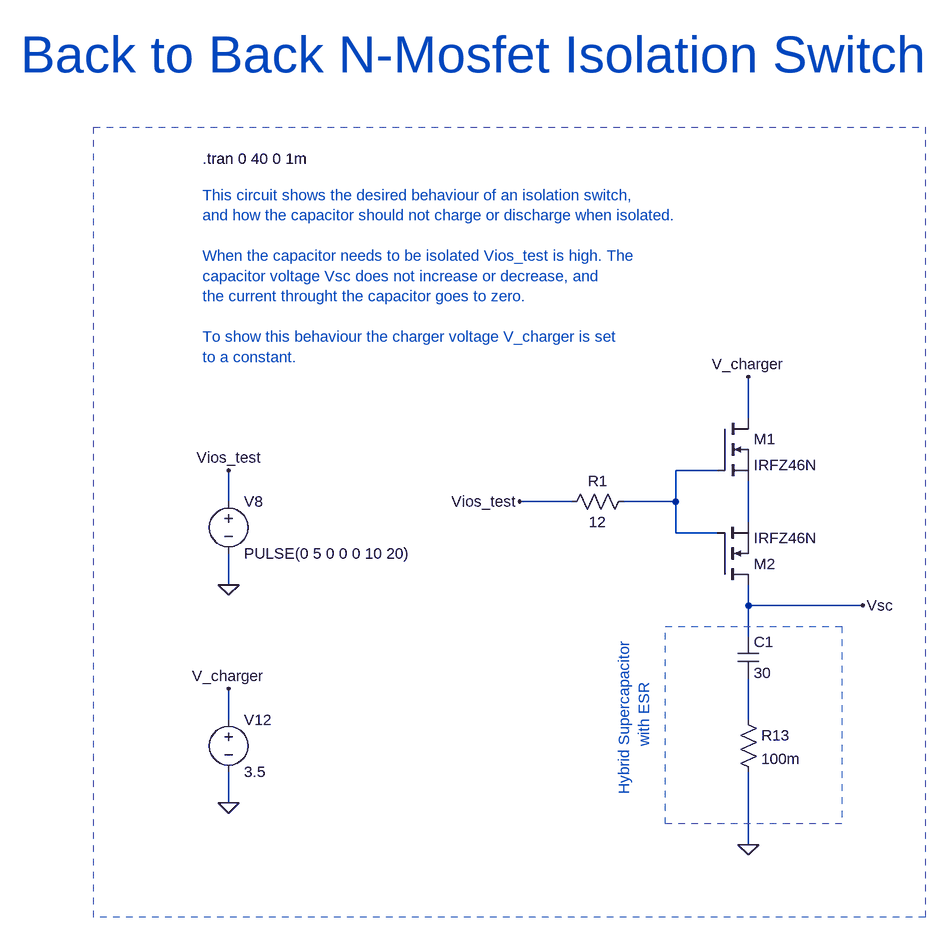
[diagram p0: schematic isolation_switch.asc]
isolation_switch.asc, the LTspice schematic file:
Version 4.1
SHEET 1 4908 2508
WIRE 4288 -160 4288 -224
WIRE 4240 -80 4176 -80
WIRE 3488 -32 3488 -80
WIRE 4016 -32 3936 -32
WIRE 4176 -32 4176 -80
WIRE 4176 -32 4096 -32
WIRE 4288 0 4288 -64
WIRE 4176 16 4176 -32
WIRE 4240 16 4176 16
WIRE 3488 96 3488 48
WIRE 4288 128 4288 96
WIRE 4464 128 4288 128
WIRE 4288 176 4288 128
WIRE 3488 304 3488 256
WIRE 4288 304 4288 240
WIRE 3488 432 3488 384
WIRE 4288 496 4288 384
FLAG 4288 496 0
FLAG 3488 96 0
FLAG 3488 -80 Vios_test
FLAG 3936 -32 Vios_test
FLAG 3488 432 0
FLAG 3488 256 V_charger
FLAG 4288 -224 V_charger
FLAG 4464 128 Vsc
SYMBOL nmos 4240 -160 R0
SYMATTR InstName M1
SYMATTR Value IRFZ46N
SYMBOL nmos 4240 96 M180
SYMATTR InstName M2
SYMATTR Value IRFZ46N
SYMBOL cap 4272 176 R0
SYMATTR InstName C1
SYMATTR Value 30
SYMBOL res 4272 288 R0
SYMATTR InstName R13
SYMATTR Value 100m
SYMBOL voltage 3488 -48 R0
WINDOW 123 0 0 Left 0
WINDOW 39 0 0 Left 0
SYMATTR InstName V8
SYMATTR Value PULSE(0 5 0 0 0 10 20)
SYMBOL voltage 3488 288 R0
WINDOW 123 0 0 Left 0
WINDOW 39 0 0 Left 0
SYMATTR InstName V12
SYMATTR Value 3.5
SYMBOL res 4112 -48 R90
WINDOW 0 0 56 VBottom 2
WINDOW 3 32 56 VTop 2
SYMATTR InstName R1
SYMATTR Value 12
TEXT 3448 -504 Left 2 ;This circuit shows the desired behaviour of an isolation switch,\nand how the capacitor should not charge or discharge when isolated.\n \nWhen the capacitor needs to be isolated Vios_test is high. The \ncapacitor voltage Vsc does not increase or decrease, and\nthe current throught the capacitor goes to zero.\n \nTo show this behaviour the charger voltage V_charger is set\nto a constant.
TEXT 3168 -720 Left 6 ;Back to Back N-Mosfet Isolation Switch
TEXT 4112 296 VCenter 2 ;Hybrid Supercapacitor \nwith ESR
TEXT 3448 -560 Left 2 !.tran 0 40 0 1m
RECTANGLE Normal 4560 608 3280 -608 2
RECTANGLE Normal 4432 464 4160 160 2

The netlist it stands for:
* isolation_switch.asc
M1 V_charger N001 N002 N002 IRFZ46N
M2 Vsc N001 N002 N002 IRFZ46N
C1 Vsc N003 30
R13 N003 0 100m
V8 Vios_test 0 PULSE(0 5 0 0 0 10 20)
V12 V_charger 0 3.5
R1 N001 Vios_test 12
.model NMOS NMOS
.model PMOS PMOS
.lib standard.mos
* This circuit shows the desired behaviour of an isolation switch,
* and how the capacitor should not charge or discharge when isolated.
* When the capacitor needs to be isolated Vios_test is high. The
* capacitor voltage Vsc does not increase or decrease, and
* the current throught the capacitor goes to zero.
* To show this behaviour the charger voltage V_charger is set
* to a constant.
* Back to Back N-Mosfet Isolation Switch
* Hybrid Supercapacitor
* with ESR
.tran 0 40 0 1m
.backanno
.end

* Results of the author's LTspice run, read from the files saved beside the schematic
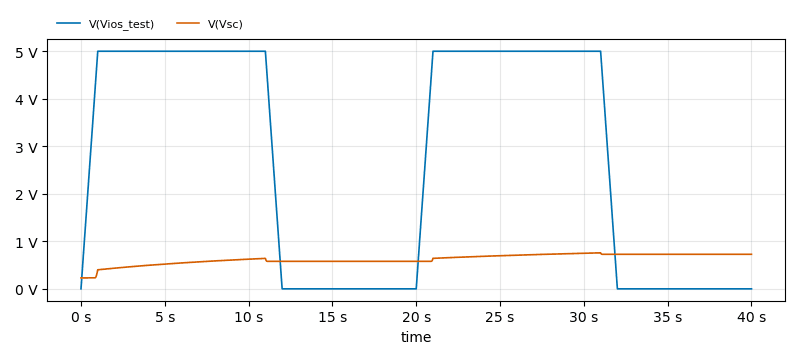
[diagram p1: Transient Analysis of isolation_switch.asc, plotted from the saved traces]
* Transient Analysis, 1 run:
*   V(Vios_test): min 0 V, max 5 V, average 2.75 V, rms 3.652 V, last 0 V
*   V(Vsc): min 229.7 mV, max 757.8 mV, average 625.1 mV, rms 634.3 mV, last 726.9 mV